# EAGLE schematic ArmBoardNew-New_Main_Board (EAGLE 8.4.3)
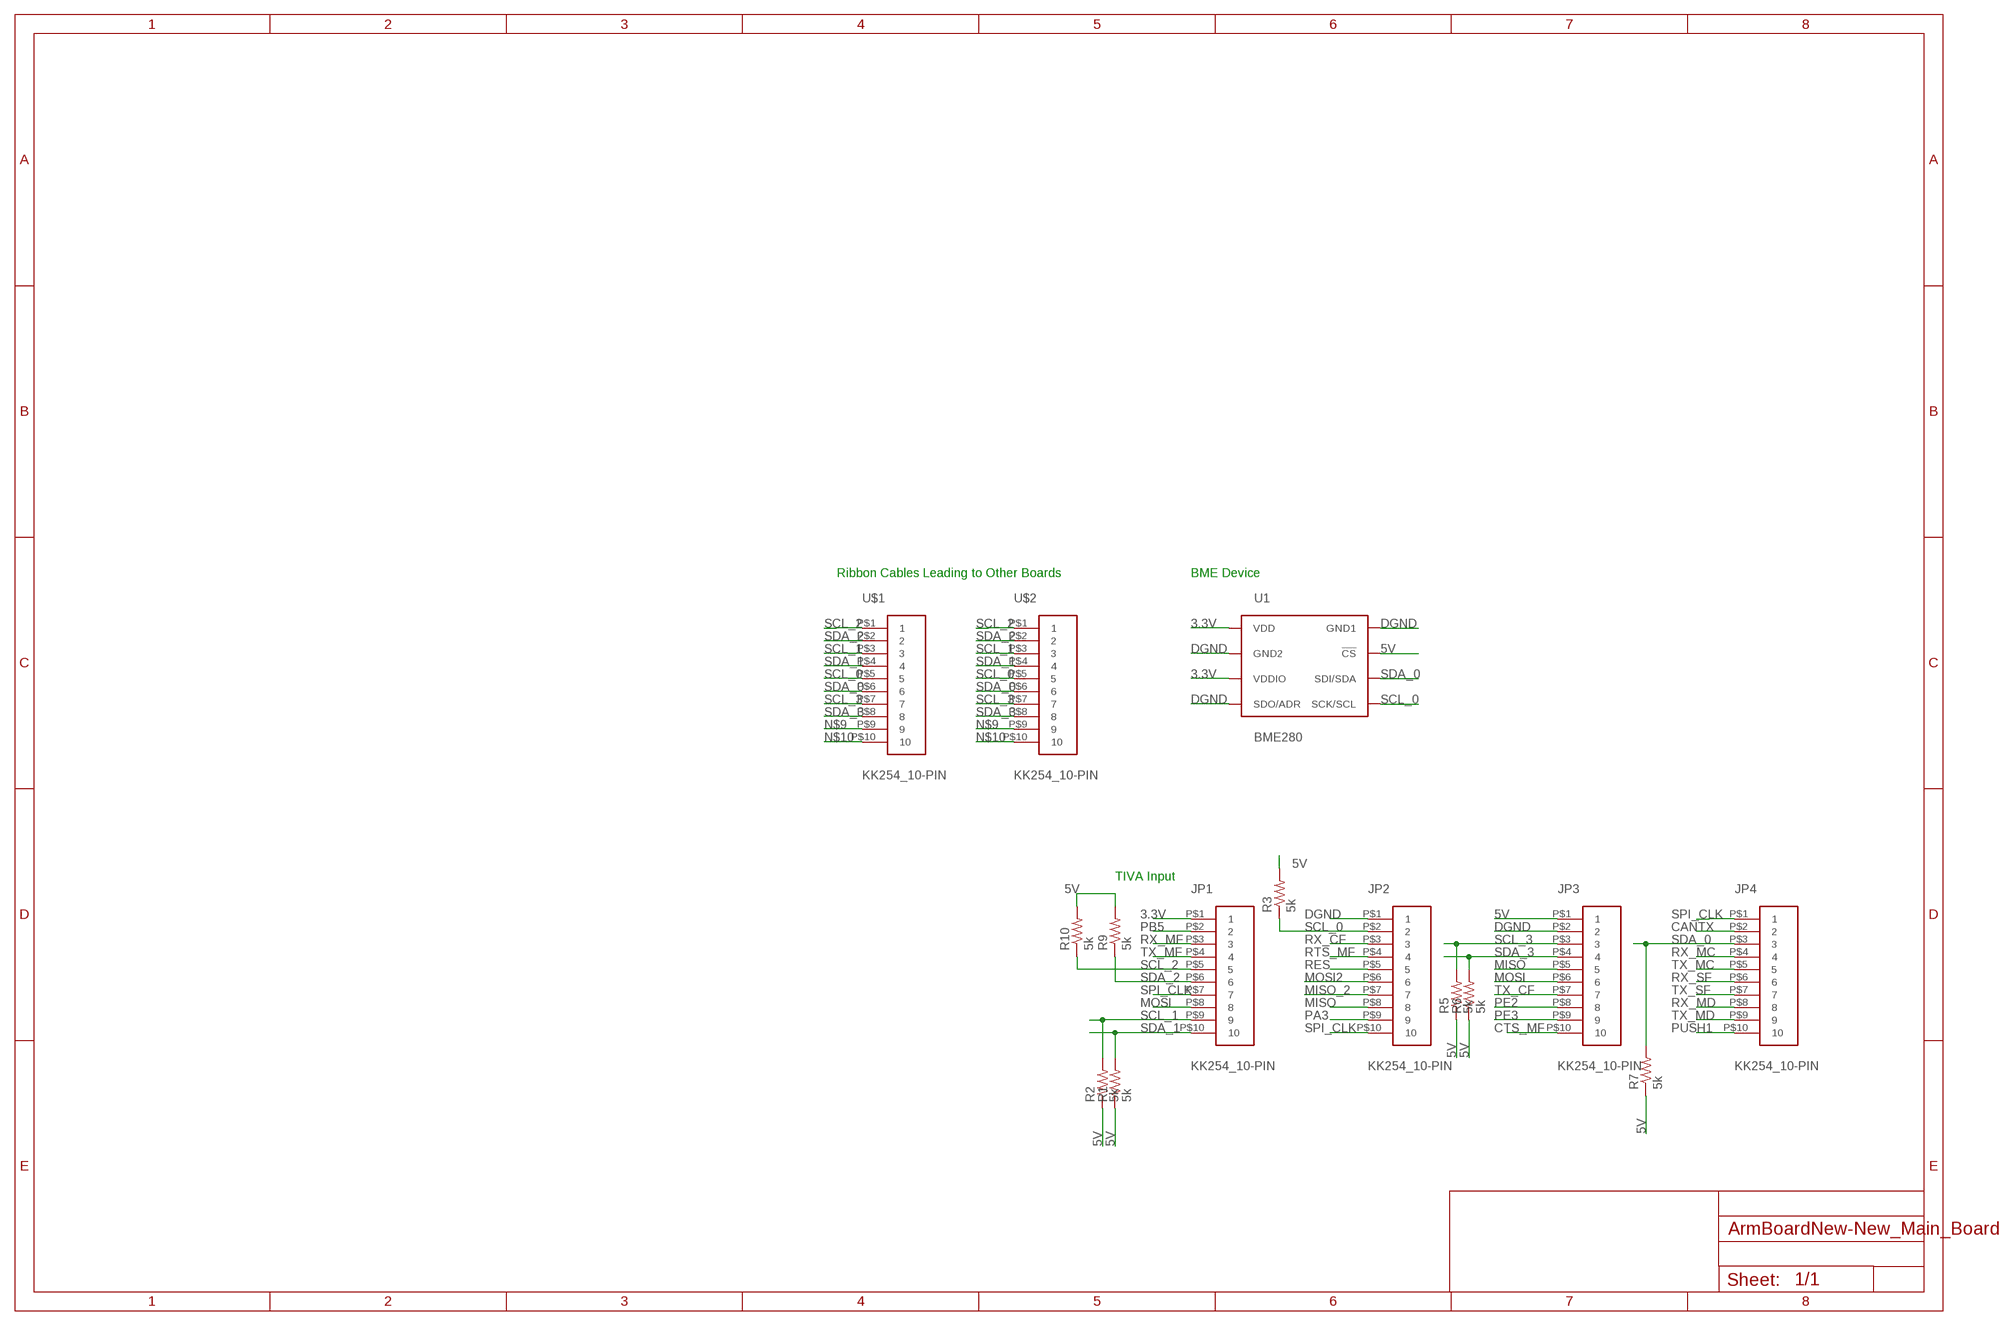
[diagram p0: schematic, sheet 1]

## Parts
JP1  KK254_10-PIN  [KK254_10-PIN]
JP2  KK254_10-PIN  [KK254_10-PIN]
JP3  KK254_10-PIN  [KK254_10-PIN]
JP4  KK254_10-PIN  [KK254_10-PIN]
R1  5k  R-US_R0805  [R0805]
R2  5k  R-US_R0805  [R0805]
R3  5k  R-US_R0805  [R0805]
R5  5k  R-US_R0805  [R0805]
R6  5k  R-US_R0805  [R0805]
R7  5k  R-US_R0805  [R0805]
R9  5k  R-US_R0805  [R0805]
R10  5k  R-US_R0805  [R0805]
U1  BME280  [BME280_LGA]
U$1  KK254_10-PIN  [KK254_10-PIN]
U$2  KK254_10-PIN  [KK254_10-PIN]

## Nets
3.3V: JP1.P$1 U1.P$6(VDDIO) U1.P$8(VDD)
5V: JP3.P$1 R1.1 R2.1 R3.2 R5.1 R6.1 R7.1 R9.2 R10.2 U1.P$2(!CS)
CANTX: JP4.P$2
CTS_MF: JP3.P$10
DGND: JP2.P$1 JP3.P$2 U1.P$1(GND1) U1.P$5(SDO/ADR) U1.P$7(GND2)
MISO: JP2.P$8 JP3.P$5
MISO_2: JP2.P$7
MOSI: JP1.P$8 JP3.P$6
MOSI2: JP2.P$6
N$9: U$1.P$9 U$2.P$9
N$10: U$1.P$10 U$2.P$10
PA3: JP2.P$9
PB5: JP1.P$2
PE2: JP3.P$8
PE3: JP3.P$9
PUSH1: JP4.P$10
RES: JP2.P$5
RTS_MF: JP2.P$4
RX_CF: JP2.P$3
RX_MC: JP4.P$4
RX_MD: JP4.P$8
RX_MF: JP1.P$3
RX_SF: JP4.P$6
SCL_0: JP2.P$2 R3.1 U1.P$4(SCK/SCL) U$1.P$5 U$2.P$5
SCL_1: JP1.P$9 R2.2 U$1.P$3 U$2.P$3
SCL_2: JP1.P$5 R10.1 U$1.P$1 U$2.P$1
SCL_3: JP3.P$3 R5.2 U$1.P$7 U$2.P$7
SDA_0: JP4.P$3 R7.2 U1.P$3(SDI/SDA) U$1.P$6 U$2.P$6
SDA_1: JP1.P$10 R1.2 U$1.P$4 U$2.P$4
SDA_2: JP1.P$6 R9.1 U$1.P$2 U$2.P$2
SDA_3: JP3.P$4 R6.2 U$1.P$8 U$2.P$8
SPI_CLK: JP1.P$7 JP2.P$10 JP4.P$1
TX_CF: JP3.P$7
TX_MC: JP4.P$5
TX_MD: JP4.P$9
TX_MF: JP1.P$4
TX_SF: JP4.P$7

## Notes on the sheet
- Ribbon Cables Leading to Other Boards | BME Device
- TIVA Input

## Library data of the parts
JP1-JP4 U$1 U$2 = molex:KK254_10-PIN: KK254 10-pin Datasheet <http://www.molex.com/molex/products/datasheet.jsp?part=active/0022102101_PCB_HEADERS.xml>
R1-R3 R5-R7 R9 R10 = resistor:R-US_: RESISTOR, American symbol
U1 = BME280ComponentLibrary:BME280; PROD_ID: IC-13090